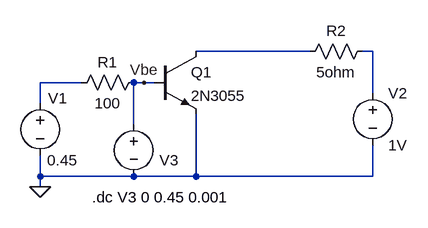
[diagram p0: schematic Transistor-Ib(Vbe).asc]
Transistor-Ib(Vbe).asc, the LTspice schematic file:
Version 4
SHEET 1 880 680
WIRE 384 80 208 80
WIRE 480 80 464 80
WIRE 32 128 -32 128
WIRE 128 128 112 128
WIRE 144 128 128 128
WIRE 480 144 480 80
WIRE -32 160 -32 128
WIRE 112 192 112 128
WIRE -32 272 -32 240
WIRE 112 272 -32 272
WIRE 208 272 208 176
WIRE 208 272 112 272
WIRE 480 272 480 224
WIRE 480 272 208 272
WIRE -32 288 -32 272
FLAG -32 288 0
FLAG 128 128 Vbe
SYMBOL res 16 144 R270
WINDOW 0 32 56 VTop 2
WINDOW 3 0 56 VBottom 2
SYMATTR InstName R1
SYMATTR Value 100
SYMBOL voltage -32 144 R0
WINDOW 123 0 0 Left 0
WINDOW 39 0 0 Left 0
WINDOW 0 12 8 Left 2
WINDOW 3 11 103 Left 2
SYMATTR InstName V1
SYMATTR Value 0.45
SYMBOL npn 144 80 R0
SYMATTR InstName Q1
SYMATTR Value 2N3055
SYMBOL res 480 64 R90
WINDOW 0 0 56 VBottom 2
WINDOW 3 32 56 VTop 2
SYMATTR InstName R2
SYMATTR Value 5ohm
SYMBOL voltage 480 128 R0
SYMATTR InstName V2
SYMATTR Value 1V
SYMBOL voltage 112 176 R0
WINDOW 0 40 71 Left 2
WINDOW 3 32 82 Invisible 2
WINDOW 123 0 0 Left 0
SYMATTR InstName V3
SYMATTR Value 0.5
SYMATTR SpiceLine Rser=1m
TEXT 48 304 Left 2 !.dc V3 0 0.45 0.001

The netlist it stands for:
* Transistor-Ib(Vbe).asc
R1 N003 Vbe 100
V1 N003 0 0.45
Q1 N001 Vbe 0 0 2N3055
R2 N002 N001 5ohm
V2 N002 0 1V
V3 Vbe 0 0.5 Rser=1m
.model NPN NPN
.model PNP PNP
.lib standard.bjt
.dc V3 0 0.45 0.001
.backanno
.end